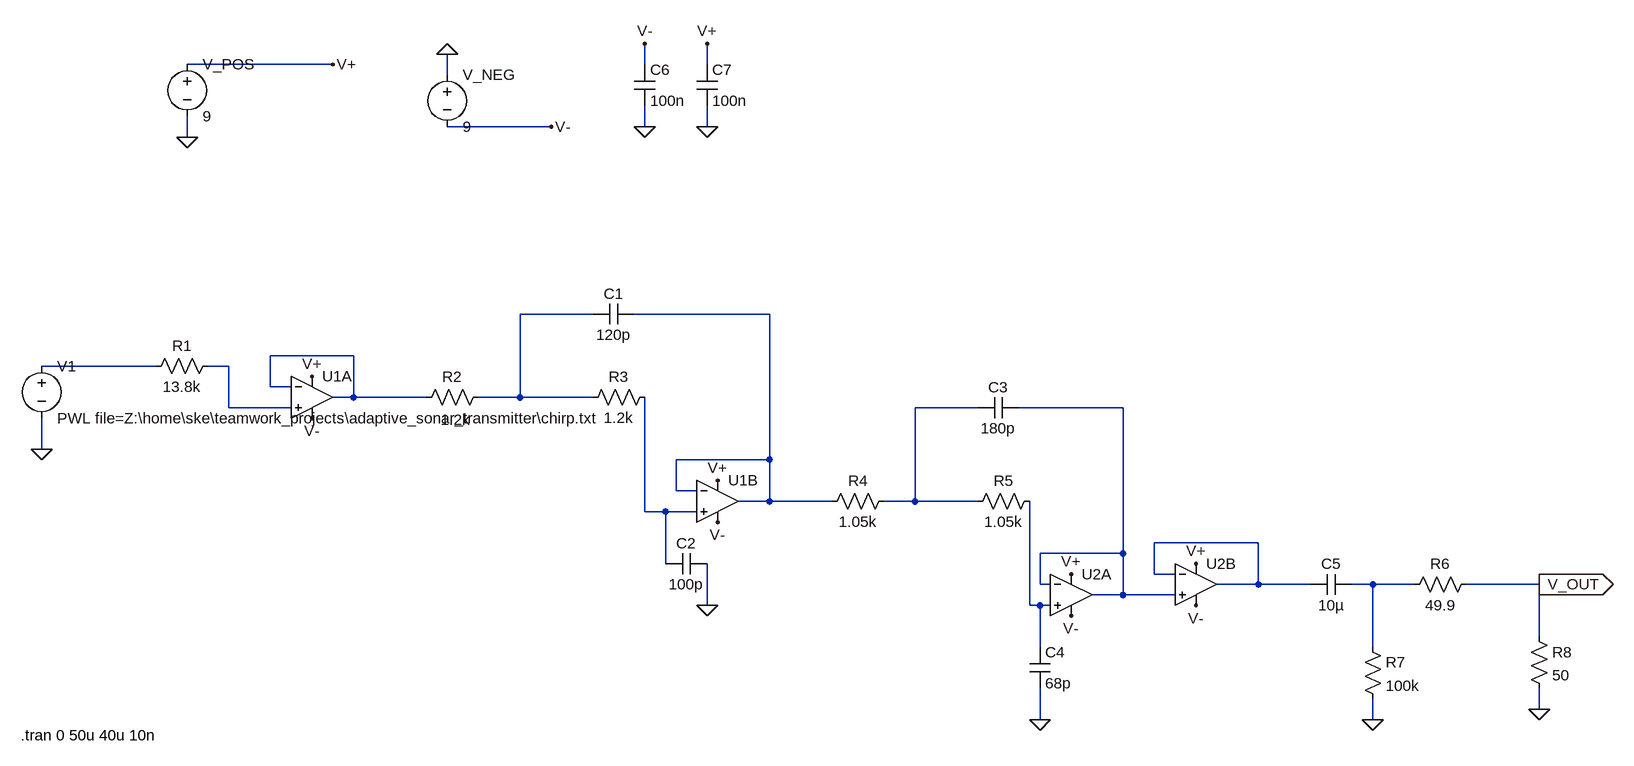
[diagram p0: schematic AFE_draft1.asc]
AFE_draft1.asc, the LTspice schematic file:
Version 4.1
SHEET 1 2416 680
WIRE 416 -400 192 -400
WIRE 896 -400 896 -432
WIRE 992 -400 992 -432
WIRE 592 -384 592 -416
WIRE 752 -304 592 -304
WIRE 896 -304 896 -336
WIRE 992 -304 992 -336
WIRE 192 -288 192 -320
WIRE 816 -16 704 -16
WIRE 1088 -16 880 -16
WIRE 448 48 320 48
WIRE 144 64 -32 64
WIRE 256 64 224 64
WIRE 320 96 320 48
WIRE 352 96 320 96
WIRE 448 112 448 48
WIRE 448 112 416 112
WIRE 560 112 448 112
WIRE 704 112 704 -16
WIRE 704 112 640 112
WIRE 816 112 704 112
WIRE 256 128 256 64
WIRE 352 128 256 128
WIRE 1408 128 1312 128
WIRE 1632 128 1472 128
WIRE -32 192 -32 144
WIRE 1088 208 1088 -16
WIRE 1088 208 944 208
WIRE 944 256 944 208
WIRE 976 256 944 256
WIRE 1088 272 1088 208
WIRE 1088 272 1040 272
WIRE 1184 272 1088 272
WIRE 1312 272 1312 128
WIRE 1312 272 1264 272
WIRE 1408 272 1312 272
WIRE 896 288 896 112
WIRE 928 288 896 288
WIRE 976 288 928 288
WIRE 1840 336 1680 336
WIRE 1632 352 1632 128
WIRE 1632 352 1504 352
WIRE 928 368 928 288
WIRE 1680 384 1680 336
WIRE 1712 384 1680 384
WIRE 1504 400 1504 352
WIRE 1520 400 1504 400
WIRE 1840 400 1840 336
WIRE 1840 400 1776 400
WIRE 1920 400 1840 400
WIRE 2016 400 1984 400
WIRE 2080 400 2016 400
WIRE 2272 400 2160 400
WIRE 1632 416 1632 352
WIRE 1632 416 1584 416
WIRE 1712 416 1632 416
WIRE 992 432 992 368
WIRE 1488 432 1488 272
WIRE 1504 432 1488 432
WIRE 1520 432 1504 432
WIRE 2272 480 2272 400
WIRE 1504 496 1504 432
WIRE 2016 496 2016 400
WIRE 2272 592 2272 560
WIRE 1504 608 1504 560
WIRE 2016 608 2016 576
FLAG -32 192 0
FLAG 992 432 0
FLAG 1504 608 0
FLAG 2016 608 0
FLAG 2272 400 V_OUT
IOPIN 2272 400 Out
FLAG 2272 592 0
FLAG 192 -288 0
FLAG 416 -400 V+
FLAG 592 -416 0
FLAG 752 -304 V-
FLAG 384 80 V+
FLAG 1008 240 V+
FLAG 1552 384 V+
FLAG 1744 368 V+
FLAG 1744 432 V-
FLAG 1552 448 V-
FLAG 1008 304 V-
FLAG 384 144 V-
FLAG 896 -432 V-
FLAG 992 -432 V+
FLAG 896 -304 0
FLAG 992 -304 0
SYMBOL voltage -32 48 R0
WINDOW 123 24 124 Left 2
WINDOW 39 0 0 Left 0
SYMATTR InstName V1
SYMATTR Value PWL file=Z:\home\ske\teamwork_projects\adaptive_sonar_transmitter\chirp.txt
SYMBOL res 240 48 R90
WINDOW 0 0 56 VBottom 2
WINDOW 3 32 56 VTop 2
SYMATTR InstName R1
SYMATTR Value 13.8k
SYMBOL OpAmps\\UniversalOpAmp2 384 112 R0
SYMATTR InstName U1A
SYMBOL res 656 96 R90
WINDOW 0 0 56 VBottom 2
WINDOW 3 35 51 VTop 2
SYMATTR InstName R2
SYMATTR Value 1.2k
SYMBOL res 912 96 R90
WINDOW 0 0 56 VBottom 2
WINDOW 3 32 56 VTop 2
SYMATTR InstName R3
SYMATTR Value 1.2k
SYMBOL cap 880 -32 R90
WINDOW 0 0 32 VBottom 2
WINDOW 3 32 32 VTop 2
SYMATTR InstName C1
SYMATTR Value 120p
SYMBOL OpAmps\\UniversalOpAmp2 1008 272 R0
SYMATTR InstName U1B
SYMBOL cap 992 352 R90
WINDOW 0 0 32 VBottom 2
WINDOW 3 32 32 VTop 2
SYMATTR InstName C2
SYMATTR Value 100p
SYMBOL res 1280 256 R90
WINDOW 0 0 56 VBottom 2
WINDOW 3 32 56 VTop 2
SYMATTR InstName R4
SYMATTR Value 1.05k
SYMBOL res 1504 256 R90
WINDOW 0 0 56 VBottom 2
WINDOW 3 32 56 VTop 2
SYMATTR InstName R5
SYMATTR Value 1.05k
SYMBOL cap 1472 112 R90
WINDOW 0 0 32 VBottom 2
WINDOW 3 32 32 VTop 2
SYMATTR InstName C3
SYMATTR Value 180p
SYMBOL OpAmps\\UniversalOpAmp2 1552 416 R0
SYMATTR InstName U2A
SYMBOL cap 1488 496 R0
SYMATTR InstName C4
SYMATTR Value 68p
SYMBOL OpAmps\\UniversalOpAmp2 1744 400 R0
SYMATTR InstName U2B
SYMBOL cap 1984 384 R90
WINDOW 0 0 32 VBottom 2
WINDOW 3 32 32 VTop 2
SYMATTR InstName C5
SYMATTR Value 10µ
SYMBOL res 2176 384 R90
WINDOW 0 0 56 VBottom 2
WINDOW 3 32 56 VTop 2
SYMATTR InstName R6
SYMATTR Value 49.9
SYMBOL res 2000 480 R0
SYMATTR InstName R7
SYMATTR Value 100k
SYMATTR SpiceLine pwr=0.25
SYMBOL res 2256 464 R0
SYMATTR InstName R8
SYMATTR Value 50
SYMATTR SpiceLine pwr=0.25
SYMBOL voltage 192 -416 R0
WINDOW 123 0 0 Left 0
WINDOW 39 0 0 Left 0
SYMATTR InstName V_POS
SYMATTR Value 9
SYMBOL voltage 592 -400 R0
WINDOW 123 0 0 Left 0
WINDOW 39 0 0 Left 0
SYMATTR InstName V_NEG
SYMATTR Value 9
SYMBOL cap 880 -400 R0
SYMATTR InstName C6
SYMATTR Value 100n
SYMBOL cap 976 -400 R0
SYMATTR InstName C7
SYMATTR Value 100n
TEXT -64 632 Left 2 !.tran 0 50u 40u 10n

The netlist it stands for:
* AFE_draft1.asc
V1 N004 0 PWL file=Z:\home\ske\teamwork_projects\adaptive_sonar_transmitter\chirp.txt
R1 N005 N004 13.8k
X§U1A N005 N003 V+ V- N003 level2 Avol=1Meg GBW=10Meg Slew=10Meg Ilimit=25m Rail=0 Vos=0 En=0 Enk=0 In=0 Ink=0 Rin=500Meg  ; pins In+ In- V+ V- OUT
R2 N001 N003 1.2k
R3 N008 N001 1.2k
C1 N002 N001 120p
X§U1B N008 N002 V+ V- N002 level2 Avol=1Meg GBW=10Meg Slew=10Meg Ilimit=25m Rail=0 Vos=0 En=0 Enk=0 In=0 Ink=0 Rin=500Meg  ; pins In+ In- V+ V- OUT
C2 0 N008 100p
R4 N006 N002 1.05k
R5 N011 N006 1.05k
C3 N007 N006 180p
X§U2A N011 N007 V+ V- N007 level2 Avol=1Meg GBW=10Meg Slew=10Meg Ilimit=25m Rail=0 Vos=0 En=0 Enk=0 In=0 Ink=0 Rin=500Meg  ; pins In+ In- V+ V- OUT
C4 N011 0 68p
X§U2B N007 N009 V+ V- N009 level2 Avol=1Meg GBW=10Meg Slew=10Meg Ilimit=25m Rail=0 Vos=0 En=0 Enk=0 In=0 Ink=0 Rin=500Meg  ; pins In+ In- V+ V- OUT
C5 N010 N009 10µ
R6 V_OUT N010 49.9
R7 N010 0 100k pwr=0.25
R8 V_OUT 0 50 pwr=0.25
V_POS V+ 0 9
V_NEG 0 V- 9
C6 V- 0 100n
C7 V+ 0 100n
.tran 0 50u 40u 10n
.lib UniversalOpAmp2.lib
.backanno
.end